# Altium project GPS_PCB.PrjPcb
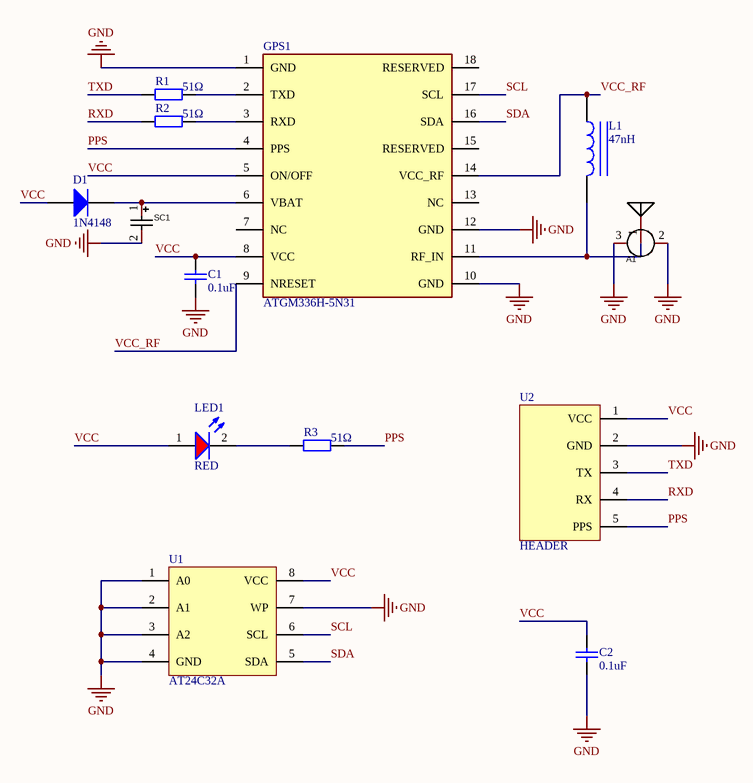
[diagram p0: GPS.SchDoc]
1 sheet, 13 parts. Net scope: global (net labels, ports and power ports of the same name join across sheets).
Board file: GPS.PcbDoc

## Sheet GPS.SchDoc
size A4; SheetNumber: 1; SheetTotal: 1

### Parts
A1  IPEX1-TXZ  [ipex1]  (value not drawn)
C1  0.1uF  [0603_C]
C2  0.1uF  [0603_C]
D1  1N4148  [1N4148]
GPS1  ATGM336H-5N31  [ATGM336H-5N-31]
L1  47nH  [0603_L]
LED1  RED  [LED0603]
R1  51Ω  [0603_R]
R2  51Ω  [0603_R]
R3  51Ω  [0603_R]
SC1  XH414HG-IV01E_C38065  [XH414HG]  (value not drawn)
U1  AT24C32A  [AT24C32A]
U2  HEADER  [HEADER]

### Nets
GND: A1.2 A1.3 C1.1 C2.1 GPS1.1(GND) GPS1.10(GND) GPS1.12(GND) SC1.2 U1.1(A0) U1.2(A1) U1.3(A2) U1.4(GND) U1.7(WP) U2.2(GND)
PPS: GPS1.4(PPS) R3.2 U2.5(PPS)
RXD: R2.1 U2.4(RX)
SCL: GPS1.17(SCL) U1.6(SCL)
SDA: GPS1.16(SDA) U1.5(SDA)
TXD: R1.1 U2.3(TX)
VCC: C1.2 C2.2 D1.1(A) GPS1.5(ON/OFF) GPS1.8(VCC) LED1.1 U1.8(VCC) U2.1(VCC)
VCC_RF: GPS1.9(NRESET) GPS1.14(VCC_RF) L1.1
NetA1_1: A1.1 GPS1.11(RF_IN) L1.2
NetD1_2: D1.2(K) GPS1.6(VBAT) SC1.1
NetGPS1_2: GPS1.2(TXD) R1.2
NetGPS1_3: GPS1.3(RXD) R2.2
NetLED1_2: LED1.2 R3.1

Not connected (* = marked no-connect by the designer): GPS1 7(NC) 13(NC) 15(RESERVED) 18(RESERVED)

### Library data of the parts
A1 = IPEX1-TXZ: Manufacturer: SHOU HAN(首韩); Name: IPEX1-TXZ 142; Add into BOM: yes; Symbol: IPEX1-TXZ 142; Device: IPEX1-TXZ 142; LCSC Part Name: IPEX天线座 内针 RF同轴连接器; Supplier Part: C3151745; Manufacturer Part: IPEX1-TXZ 142; Supplier Footprint: SMD; JLCPCB Part Class: Extended Part; Datasheet: https://atta.szlcsc.com/upload/public/pdf/source/20220627/A0C2EF411B6F3EC53ED1A4F491E26EB6.pdf; Supplier: LCSC; Convert to PCB: yes
C1 C2 = 0603C: capacitance
D1 = 1N4148: diode; ComponentLink1Description: 供应商链接; ComponentLink1URL: http://www.szlcsc.com/product/details_2485.html; Package: SOD-323; Supplier: LC; SuppliersPartNumber: C2128
GPS1 = ATGM336H-5N31: GSM & GPRS & GPS Modules 9.7X10.1mm RoHS; Manufacturer_Name: ZHONGKEWEI; Geometry.Height: 2.6mm; Manufacturer_Part_Number: ATGM336H-5N31; Mouser Part Number: *; Mouser Price/Stock: *; Arrow Part Number: *; Arrow Price/Stock: *; Datasheet Link: https://datasheet.lcsc.com/szlcsc/ZHONGKEWEI-ATGM336H-5N31_C90770.pdf
L1 = 0603L: inductance; ComponentLink1Description: 供应商链接; ComponentLink1URL: http://www.szlcsc.com/product/details_1398.html; Package: 0805; Supplier: LC; SuppliersPartNumber: C1046
LED1 = LED_RED_1: LED; ComponentLink1Description: 供应商链接; ComponentLink1URL: http://www.szlcsc.com/product/details_2659.html; Package: 0603; Supplier: LC; SuppliersPartNumber: C2286
R1-R3 = 0603R: resistance; ComponentLink1Description: 供应商链接; ComponentLink1URL: http://www.szlcsc.com/product/details_26562.html; Package: 0603; Supplier: LC; SuppliersPartNumber: C25819
SC1 = XH414HG: super capicator; Manufacturer: ABLIC(艾普凌科); Name: 80000uF; Add into BOM: yes; Value: 80000uF; Rated Voltage: 3.3V; Cycle Life Expectancy: 10000; φD: 4.8mm; Symbol: XH414HG-IV01E; Device: XH414HG-IV01E_C38065; LCSC Part Name: 80000uF 3.3V; Supplier Part: C38065; Manufacturer Part: XH414HG-IV01E; Supplier Footprint: SMD,4.8x1.85mm; JLCPCB Part Class: Extended Part; Datasheet: https://atta.szlcsc.com/upload/public/pdf/source/20150910/1457707350979.pdf; Supplier: LCSC; Convert to PCB: yes; Equivalent Series Resistance(ESR): -; Leakage Current(DCL): -; Lifetime @ Temp: -; Operating Temperature: -20℃~+60℃; Body Height: -